# EasyEDA schematic SCH_power_2025-01-19.json
TITLE: Sheet_1; REV: 1.0; Date: 2024-10-05; Sheet: 1/1; Drawn By: ruihan.zhao13147-bihz; Company: Your Company
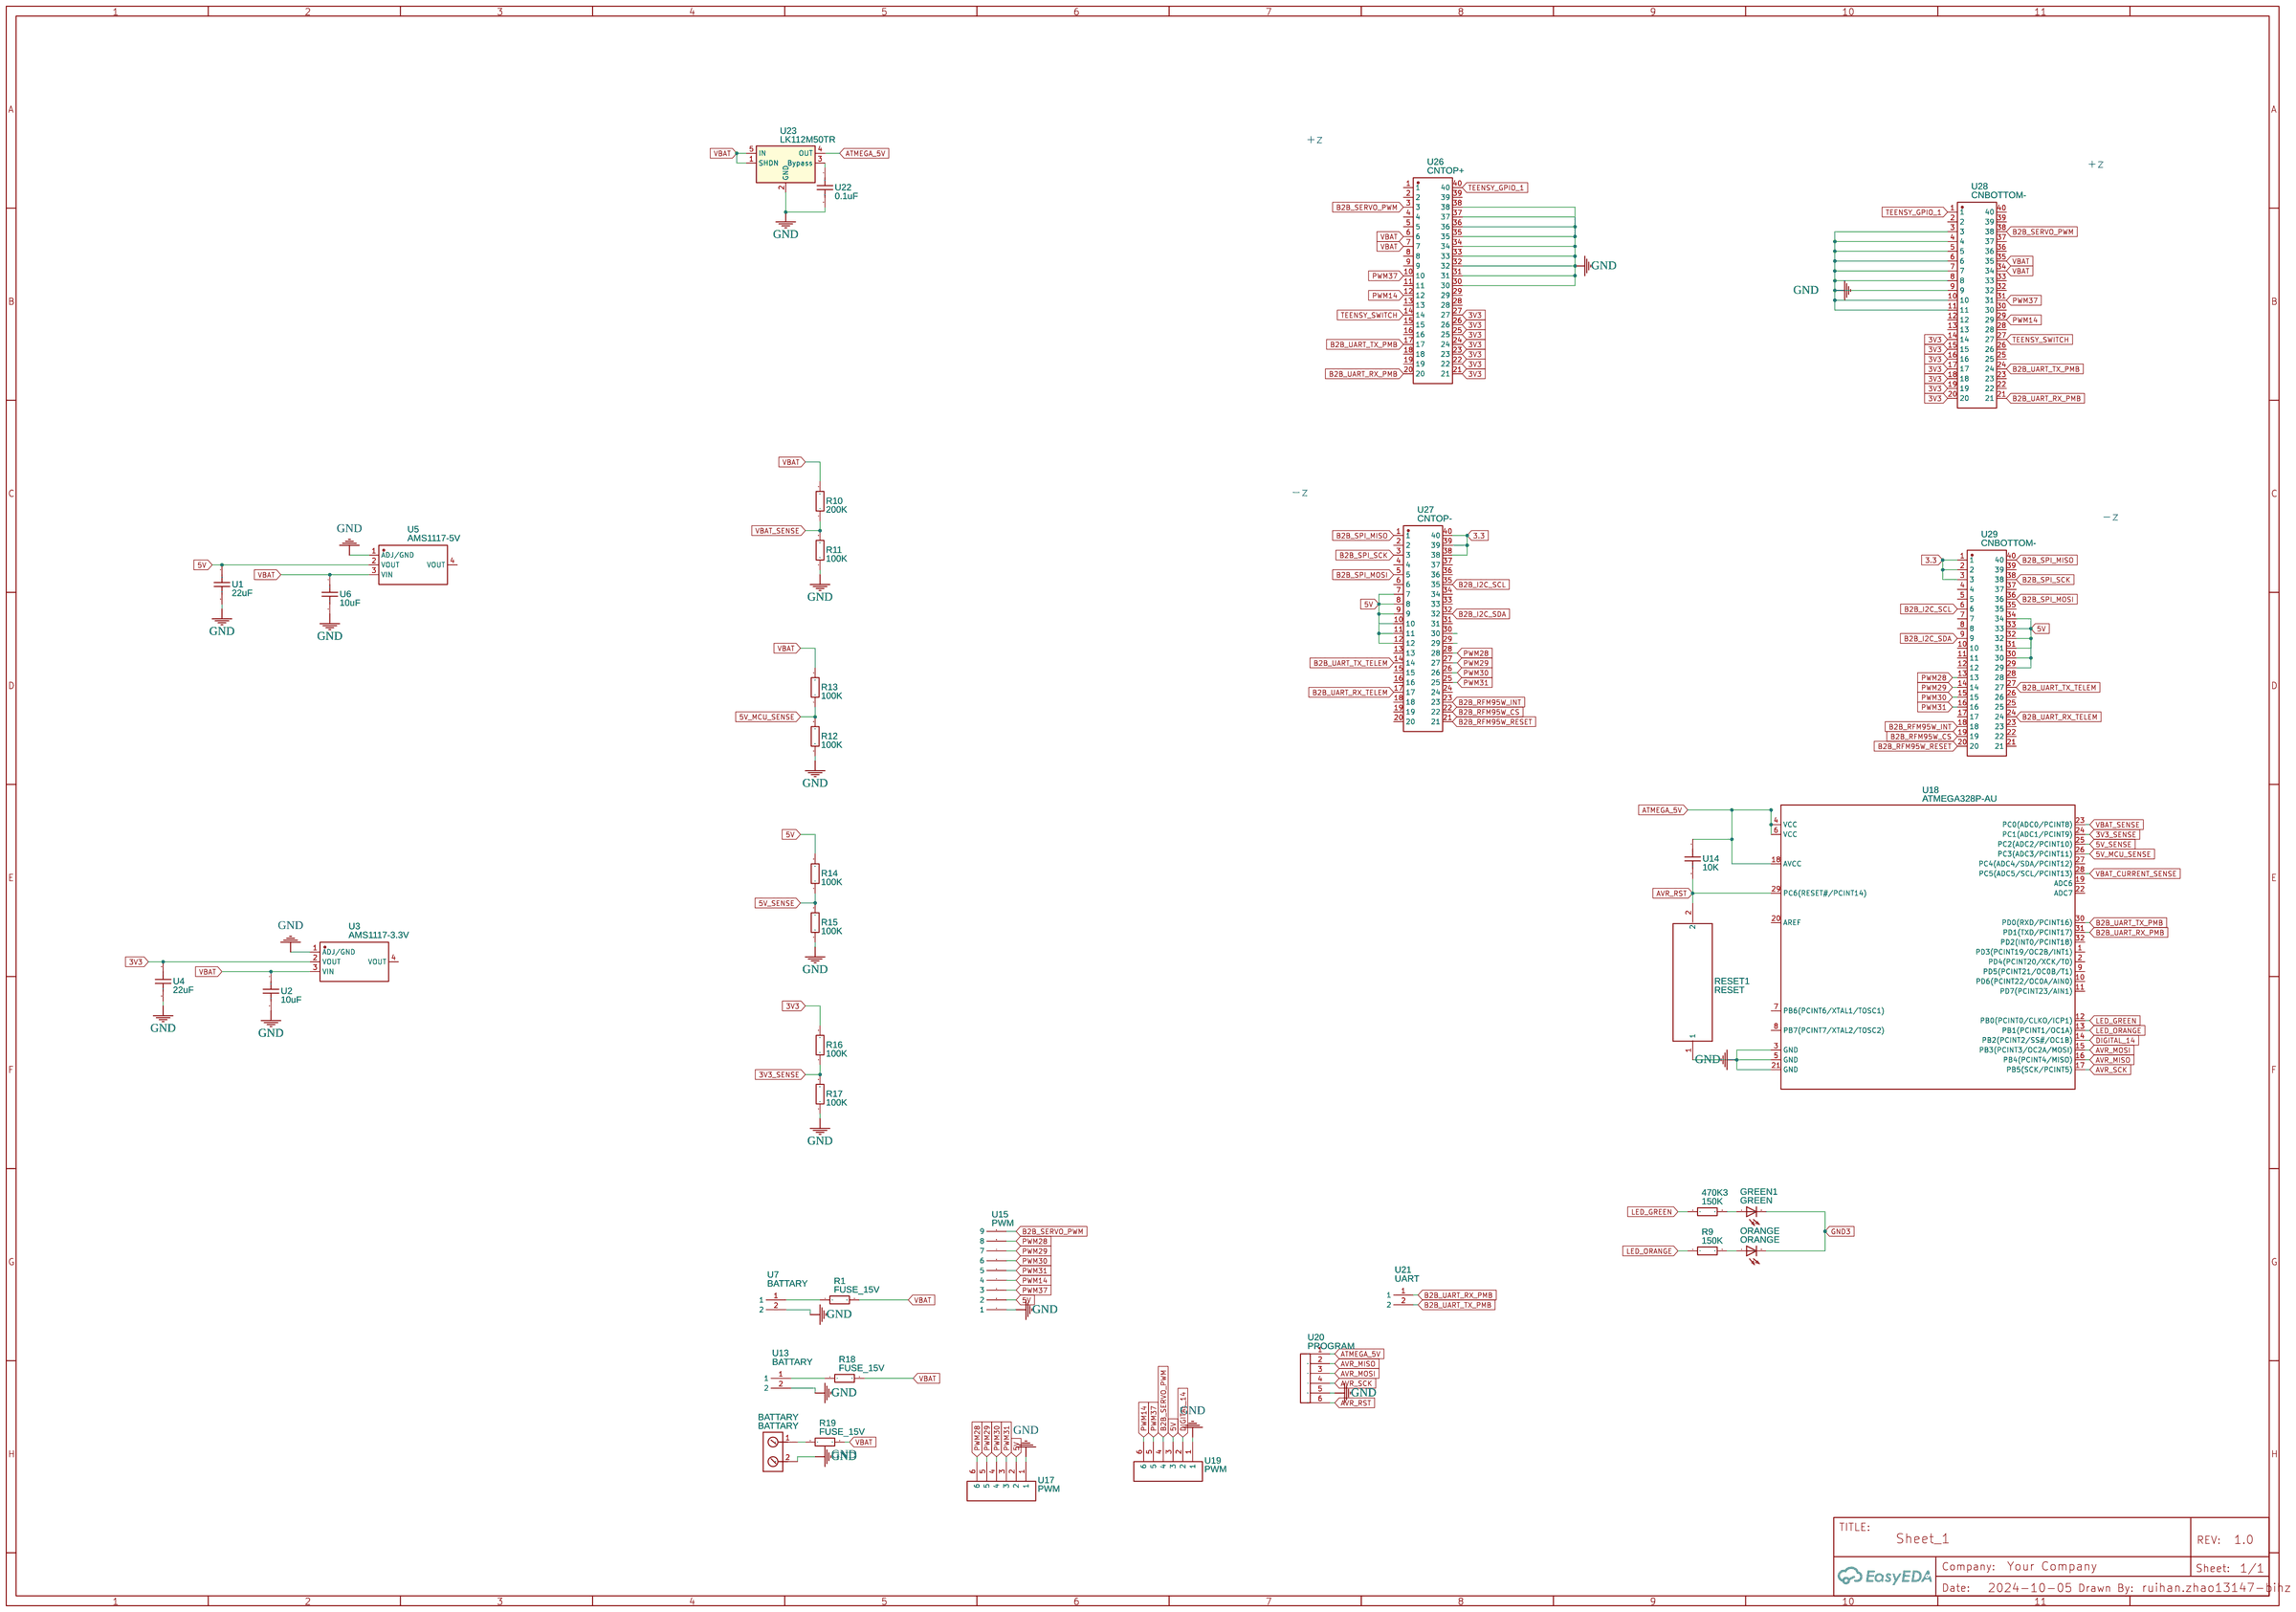
[diagram p0: schematic sheet]

## Parts
470K3  150K  [0805 RESISTOR FP]
BATTARY  BATTARY  [STB-5MM-2PIN FOR LED DRIVER]
GREEN1  GREEN  [CHIP-LED0805]
ORANGE  ORANGE  [CHIP-LED0805]
R1  FUSE_15V  [R0805]
R9  150K  [0805 RESISTOR FP]
R10  200K  [R0805]
R11  100K  [R0805]
R12  100K  [R0805]
R13  100K  [R0805]
R14  100K  [R0805]
R15  100K  [R0805]
R16  100K  [R0805]
R17  100K  [R0805]
R18  FUSE_15V  [R0805]
R19  FUSE_15V  [R0805]
RESET1  RESET  [SWITCH_FSMSM]
U1  22uF  [C0805]
U2  10uF  [C0805]
U3  AMS1117-3.3V  [SOT-223-4_L6.5-W3.5-P2.30-LS7.0-BR]
U4  22uF  [C0805]
U5  AMS1117-5V  [SOT-223-4_L6.5-W3.5-P2.30-LS7.0-BR]
U6  10uF  [C0805]
U7  BATTARY  [2 PIN HEADERS (PIN = 2.54)]
U13  BATTARY  [2 PIN HEADERS (PIN = 2.54)]
U14  10K  [C0805]
U15  PWM  [9PINHEADER]
U17  PWM  [6PIN_5MM_CONN]
U18  ATMEGA328P-AU  [ATMEGA328P-AU]
U19  PWM  [6PIN_5MM_CONN]
U20  PROGRAM  [6PINHEADER]
U21  UART  [2 PIN HEADERS (PIN = 2.54)]
U22  0.1uF  [C0805]
U23  LK112M50TR  [SOT-23-5]
U26  CNTOP+  [CONN-SMD_40P-P0.80_SGD-JST-BM-08-2X20P-H18-GB0R02]
U27  CNTOP-  [CONN-SMD_40P-P0.80_SGD-JST-BM-08-2X20P-H18-GB0R02]
U28  CNBOTTOM-  [CONN-SMD_40P-P0.80_SGD-JST-BM-08-2X20P-H18-GB0R02]
U29  CNBOTTOM-  [CONN-SMD_40P-P0.80_SGD-JST-BM-08-2X20P-H18-GB0R02]

## Library data of the parts
470K3 R9 = 0805 Resistor: Contributor: Zephyr Computer Systems
BATTARY = STB-5MM-2PIN: Contributor: GURBUZ
GREEN1 ORANGE = LEDCHIP-LED0805: Contributor: Axelpwm
R1 R10-R19 = 0805: Contributor: LCSC; Supplier: LCSC; Supplier Part: C9900012715; Manufacturer: null; JLCPCB Part Class: Extended Part
RESET1 = FSMSM: Contributor: marty62
U1 U2 U4 U6 U14 U22 = CAP-C0805: Contributor: LCSC; Supplier: LCSC; Supplier Part: C9900009346; Manufacturer: null; JLCPCB Part Class: Extended Part
U3 U5 = AMS1117-3.3V: Contributor: LCSC; Supplier: LCSC; Supplier Part: C2688239; Manufacturer: WPMtek(维攀); JLCPCB Part Class: Extended Part
U7 U13 U21 = 2 pin header: Contributor: ruihan.zhao13147-bihz
U15 = 9 Pin Header: Manufacturer Part: 6 Pin Header; Contributor: Martí Gibert Roca
U17 U19 = 6PIN_5MM: Contributor: sjoerd2
U18 = ATMEGA328P-AU: Contributor: Dridri139090
U20 = 6 pin header: Contributor: adamtaylor5000
U23 = LK112M50TR: Contributor: Deven Corella (Fretless)
U26-U29 = SGDBM-08-40P: Contributor: LCSC; Supplier: LCSC; Supplier Part: C9900010918; Manufacturer: null; JLCPCB Part Class: Extended Part

## Nets
3V3: R16.2 U3.2(VOUT) U4.1 U26.21 U26.22 U26.23 U26.24 U26.25 U26.26 U26.27 U28.14 U28.15 U28.16 U28.17 U28.18 U28.19 U28.20
3V3_SENSE: R16.1 R17.2 U18.24(PC1(ADC1/PCINT9))
5V: R14.2 U1.1 U5.2(VOUT) U15.2 U17.2 U19.3 U27.7 U27.8 U27.9 U27.10 U27.11 U27.12 U29.29 U29.30 U29.31 U29.32 U29.33 U29.34
5V_MCU_SENSE: R12.2 R13.1 U18.26(PC3(ADC3/PCINT11))
5V_SENSE: R14.1 R15.2 U18.25(PC2(ADC2/PCINT10))
GND: BATTARY.2 R11.1 R12.1 R15.1 R17.1 RESET1.1 U1.2 U2.2 U3.1(ADJ/GND) U4.2 U5.1(ADJ/GND) U6.2 U7.2 U13.2 U15.1 U17.1 U18.3(GND) U18.5(GND) U18.21(GND) U19.1 U20.5 U22.2 U23.2(GND) U26.30 U26.31 U26.32 U26.33 U26.34 U26.35 U26.36 U26.37 U26.38 U28.3 U28.4 U28.5 U28.6 U28.7 U28.8 U28.9 U28.10 U28.11
GND3: GREEN1.C ORANGE.C
VBAT: R1.2 R10.2 R13.2 R18.2 R19.2 U2.1 U3.3(VIN) U5.3(VIN) U6.1 U23.1(SHDN) U23.5(IN) U26.6 U26.7 U28.34 U28.35
VBAT_CURRENT_SENSE: U18.28(PC5(ADC5/SCL/PCINT13))
VBAT_SENSE: R10.1 R11.2 U18.23(PC0(ADC0/PCINT8))
3.3: U27.38 U27.39 U27.40 U29.1 U29.2 U29.3
ATMEGA_5V: U14.1 U18.4(VCC) U18.6(VCC) U18.18(AVCC) U20.1 U23.4(OUT)
AVR_MISO: U18.16(PB4(PCINT4/MISO)) U20.2
AVR_MOSI: U18.15(PB3(PCINT3/OC2A/MOSI)) U20.3
AVR_RST: RESET1.2 U14.2 U18.29(PC6(RESET#/PCINT14)) U20.6
AVR_SCK: U18.17(PB5(SCK/PCINT5)) U20.4
B2B_I2C_SCL: U27.35 U29.6
B2B_I2C_SDA: U27.32 U29.9
B2B_RFM95W_CS: U27.22 U29.19
B2B_RFM95W_INT: U27.23 U29.18
B2B_RFM95W_RESET: U27.21 U29.20
B2B_SERVO_PWM: U15.9 U19.4 U26.3 U28.38
B2B_SPI_MISO: U27.1 U29.40
B2B_SPI_MOSI: U27.5 U29.36
B2B_SPI_SCK: U27.3 U29.38
B2B_UART_RX_PMB: U18.31(PD1(TXD/PCINT17)) U21.1 U26.20 U28.21
B2B_UART_RX_TELEM: U27.17 U29.24
B2B_UART_TX_PMB: U18.30(PD0(RXD/PCINT16)) U21.2 U26.17 U28.24
B2B_UART_TX_TELEM: U27.14 U29.27
DIGITAL_14: U18.14(PB2(PCINT2/SS#/OC1B)) U19.2
LED_GREEN: 470K3.1 U18.12(PB0(PCINT0/CLKO/ICP1))
LED_ORANGE: R9.1 U18.13(PB1(PCINT1/OC1A))
PWM14: U15.4 U19.6 U26.12 U28.29
PWM28: U15.8 U17.6 U27.28 U29.13
PWM29: U15.7 U17.5 U27.27 U29.14
PWM30: U15.6 U17.4 U27.26 U29.15
PWM31: U15.5 U17.3 U27.25 U29.16
PWM37: U15.3 U19.5 U26.10 U28.31
TEENSY_GPIO_1: U26.40 U28.1
TEENSY_SWITCH: U26.14 U28.27
Net-(470K3-2): 470K3.2 GREEN1.A
Net-(BATTARY-1): BATTARY.1 R19.1
Net-(ORANGE-A): ORANGE.A R9.2
Net-(R1-1): R1.1 U7.1
Net-(R18-1): R18.1 U13.1
Net-(U22-1): U22.1 U23.3(Bypass)

Not connected (* = marked no-connect by the designer): U3 4(VOUT); U5 4(VOUT); U18 1(PD3(PCINT19/OC2B/INT1)) 2(PD4(PCINT20/XCK/T0)) 7(PB6(PCINT6/XTAL1/TOSC1)) 8(PB7(PCINT7/XTAL2/TOSC2)) 9(PD5(PCINT21/OC0B/T1)) 10(PD6(PCINT22/OC0A/AIN0)) 11(PD7(PCINT23/AIN1)) 19(ADC6) 20(AREF) 22(ADC7) 27(PC4(ADC4/SDA/PCINT12)) 32(PD2(INT0/PCINT18)); U26 1 2 4 5 8 9 11 13 15 16 18 19 28 29 39; U27 2 4 6 13 15 16 18 19 20 24 29 30 31 33 34 36 37; U28 2 12 13 22 23 25 26 28 30 32 33 36 37 39 40; U29 4 5 7 8 10 11 12 17 21 22 23 25 26 28 35 37 39

## Notes on the sheet
- +z
- +z
- -z
- -z
- GND
